# Altium project AQM with ESP32-S3.PrjPcb
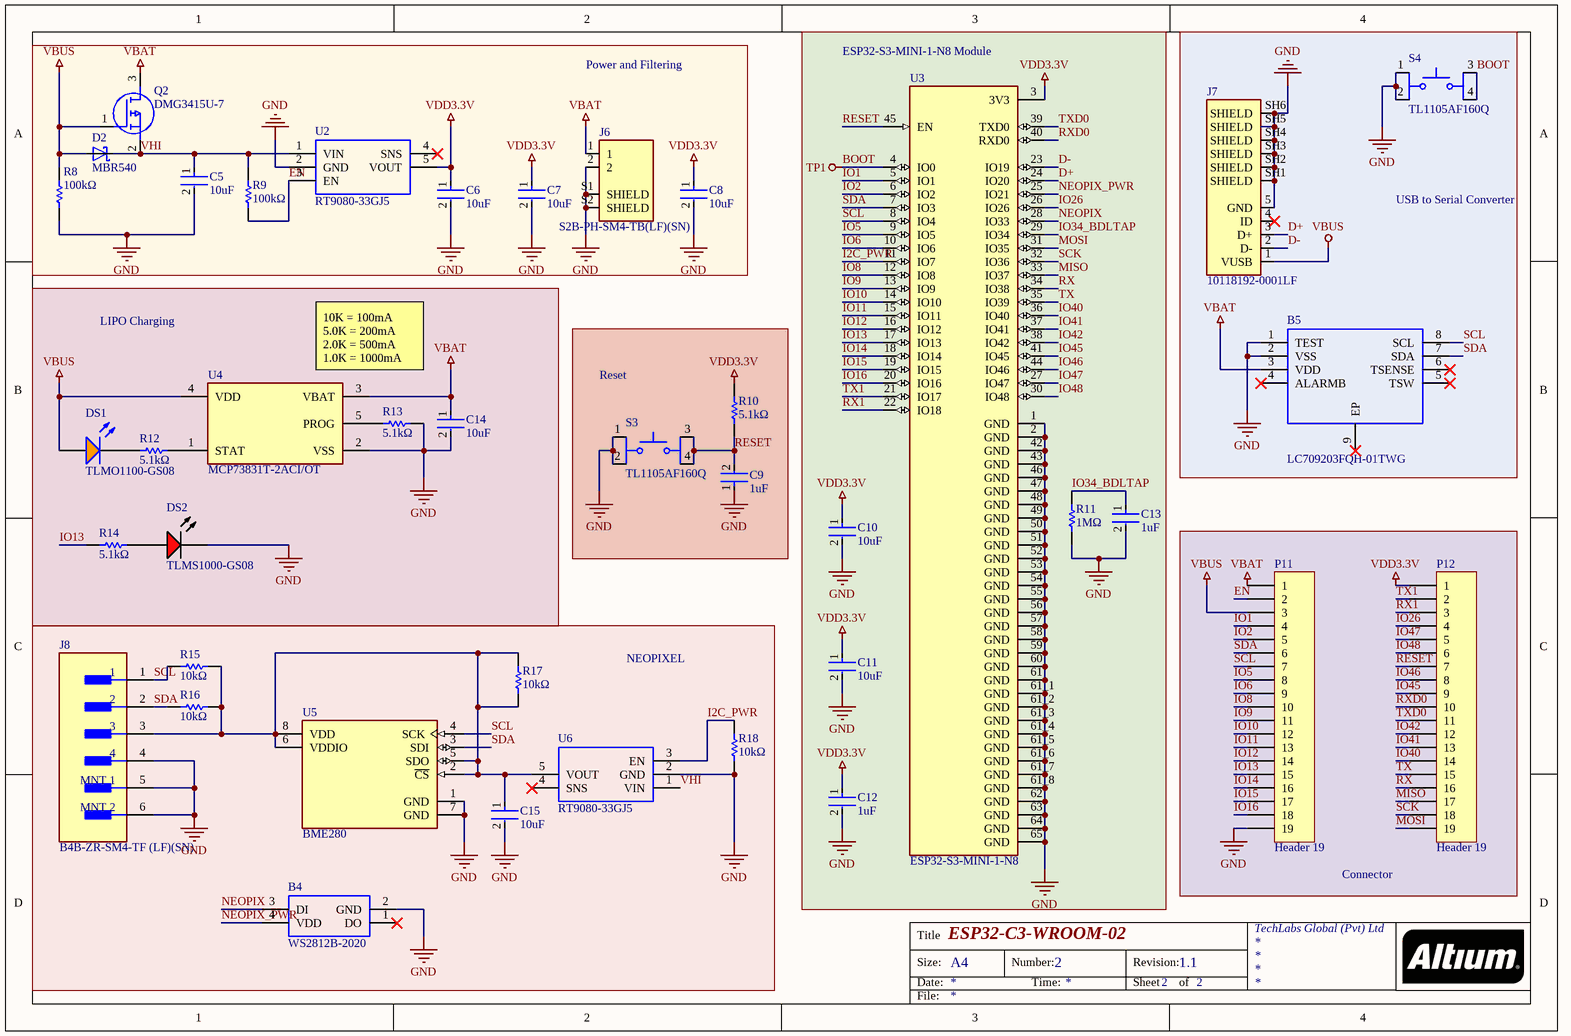
[diagram p0: ESP32-S3 module.SchDoc]
2 sheets, 76 parts. Net scope: global (net labels, ports and power ports of the same name join across sheets).
Board file: AQM with ESP32-S3.PcbDoc
Sheets:
  ESP32-S3 module.SchDoc
  AQM with esp32.SchDoc

## Sheet ESP32-S3 module.SchDoc: ESP32-C3-WROOM-02
size A4; Organization: TechLabs Global (Pvt) Ltd; DocumentNumber: 2; Revision: 1.1; SheetNumber: 2; SheetTotal: 2

### Parts
B4  WS2812B-2020  [WS2812B2020]
B5  LC709203FQH-01TWG  [SON65P400X300X80-9N]
C5  10uF  [FP-CL10-IPC_C]
C6  10uF  [FP-CL10-IPC_C]
C7  10uF  [FP-CL10-IPC_C]
C8  10uF  [FP-CL10-IPC_C]
C9  1uF  [FP-CL10-IPC_A]
C10  10uF  [FP-CL10-IPC_C]
C11  10uF  [FP-CL10-IPC_C]
C12  1uF  [FP-CL10-IPC_A]
C13  1uF  [FP-CL10-IPC_A]
C14  10uF  [FP-CL10-IPC_C]
C15  10uF  [FP-CL10-IPC_C]
D2  MBR540  [DIOAD2120W130L950D530P]
DS1  TLMO1100-GS08  [VISH-TLMX1100-2_V]
DS2  TLMS1000-GS08  [VISH-TLMS1000_V]
J6  S2B-PH-SM4-TB(LF)(SN)  [JST_S2B-PH-SM4-TB(LF)(SN)]
J7  10118192-0001LF  [AMPHENOL_10118192-0001LF]
J8  B4B-ZR-SM4-TF (LF)(SN)  [FP-B4B-ZR-SM4-TF_LF_SN-MFG]
P11  Header 19  [HDR1X19]
P12  Header 19  [HDR1X19]
Q2  DMG3415U-7  [SOT96P240X120-3N]
R8  100kΩ  [RESC1005X40X25NL05T10]
R9  100kΩ  [RESC1005X40X25NL05T10]
R10  5.1kΩ  [RESC1005X40X25NL05T10]
R11  1MΩ  [RESC1005X40X25NL05T10]
R12  5.1kΩ  [RESC1005X40X25NL05T10]
R13  5.1kΩ  [RESC1005X40X25NL05T10]
R14  5.1kΩ  [RESC1005X40X25NL05T10]
R15  10kΩ  [RESC1005X40X25LL05T10]
R16  10kΩ  [RESC1005X40X25LL05T10]
R17  10kΩ  [RESC1005X40X25LL05T10]
R18  10kΩ  [RESC1005X40X25LL05T10]
S3  TL1105AF160Q  [TL1105AF160Q]
S4  TL1105AF160Q  [TL1105AF160Q]
U2  RT9080-33GJ5  [SOT94P280X100-5N]
U3  ESP32-S3-MINI-1-N8  [XCVR_ESP32-S3-MINI-1-N8]
U4  MCP73831T-2ACI/OT  [FP-C04-091-OT-IPC_B]
U5  BME280  [FP-BME280-MFG]
U6  RT9080-33GJ5  [SOT94P280X100-5N]

### Blocks framed on the sheet
Power and Filtering: C5-C8 D2 J6 Q2 R8 R9 U2
ESP32-S3-MINI-1-N8 Module: C10-C13 R11 U3
USB to Serial Converter: B5 J7 S4
LIPO Charging: C14 DS1 DS2 R12-R14 U4
Reset: C9 R10 S3
Connector: P11 P12
NEOPIXEL: B4 C15 J8 R15-R18 U5 U6

### Nets
BOOT: S4.3 S4.4 U3.4(IO0)  [also labelled TP1]
GND: B4.2(GND) B5.1(TEST) B5.2(VSS) C5.2 C6.2 C7.2 C8.2 C9.1 C10.2 C11.2 C12.2 C13.2 C14.2 C15.2 DS2.2(K) J6.2 J6.S1(SHIELD) J6.S2(SHIELD) J7.5(GND) J7.SH1(SHIELD) J7.SH2(SHIELD) J7.SH3(SHIELD) J7.SH4(SHIELD) J7.SH5(SHIELD) J7.SH6(SHIELD) J8.4 J8.5(MNT_1) J8.6(MNT_2) P11.19 R8.1 R11.1 R13.1 R18.1 S3.1 S3.2 S4.1 S4.2 U2.2(GND) U3.1(GND) U3.2(GND) U3.42(GND) U3.43(GND) U3.46(GND) U3.47(GND) U3.48(GND) U3.49(GND) U3.50(GND) U3.51(GND) U3.52(GND) U3.53(GND) U3.54(GND) U3.55(GND) U3.56(GND) U3.57(GND) U3.58(GND) U3.59(GND) U3.60(GND) U3.61(GND) U3.61_1(GND) U3.61_2(GND) U3.61_3(GND) U3.61_4(GND) U3.61_5(GND) U3.61_6(GND) U3.61_7(GND) U3.61_8(GND) U3.62(GND) U3.63(GND) U3.64(GND) U3.65(GND) U4.2(VSS) U5.1(GND) U5.7(GND) U6.2(GND)
VBAT: B5.3(VDD) C14.1 J6.1 P11.1 Q2.3(D) U4.3(VBAT)
VBUS: D2.A DS1.1(A) J7.1(VUSB) P11.3 Q2.1(G) R8.2 U4.4(VDD)
VDD3.3V: C6.1 C7.1 C8.1 C10.1 C11.1 C12.1 P12.1 R10.2 U2.5(VOUT) U3.3(3V3)
D+: J7.3(D+) U3.24(IO20)
D-: J7.2(D-) U3.23(IO19)
EN: P11.2 R9.2 U2.3(EN)
I2C_PWR: R18.2 U3.11(IO7) U6.3(EN)
IO1: P11.4 U3.5(IO1)
IO2: P11.5 U3.6(IO2)
IO5: P11.8 U3.9(IO5)
IO6: P11.9 U3.10(IO6)
IO8: P11.10 U3.12(IO8)
IO9: P11.11 U3.13(IO9)
IO10: P11.12 U3.14(IO10)
IO11: P11.13 U3.15(IO11)
IO12: P11.14 U3.16(IO12)
IO13: P11.15 R14.2 U3.17(IO13)
IO14: P11.16 U3.18(IO14)
IO15: P11.17 U3.19(IO15)
IO16: P11.18 U3.20(IO16)
IO26: P12.4 U3.26(IO26)
IO34_BDLTAP: C13.1 R11.2 U3.29(IO34)
IO40: P12.14 U3.36(IO40)
IO41: P12.13 U3.37(IO41)
IO42: P12.12 U3.38(IO42)
IO45: P12.9 U3.41(IO45)
IO46: P12.8 U3.44(IO46)
IO47: P12.5 U3.27(IO47)
IO48: P12.6 U3.30(IO48)
MISO: P12.17 U3.33(IO37)
MOSI: P12.19 U3.31(IO35)
NEOPIX: B4.3(DI) U3.28(IO33)
NEOPIX_PWR: B4.4(VDD) U3.25(IO21)
RESET: C9.2 P12.7 R10.1 S3.3 S3.4 U3.45(EN)
RX: P12.16 U3.34(IO38)
RX1: P12.3 U3.22(IO18)
RXD0: P12.10 U3.40(RXD0)
SCK: P12.18 U3.32(IO36)
SCL: B5.8(SCL) J8.1 P11.7 R15.2 U3.8(IO4) U5.4(SCK)
SDA: B5.7(SDA) J8.2 P11.6 R16.2 U3.7(IO3) U5.3(SDI)
TX: P12.15 U3.35(IO39)
TX1: P12.2 U3.21(IO17)
TXD0: P12.11 U3.39(TXD0)
VHI: C5.1 D2.C Q2.2(S) R9.1 U2.1(VIN) U6.1(VIN)
NetC15_1: C15.1 J8.3 R15.1 R16.1 R17.1 R17.2 U5.2(~{CS}) U5.5(SDO) U5.6(VDDIO) U5.8(VDD) U6.5(VOUT)
NetDS1_2: DS1.2(K) R12.2
NetDS2_1: DS2.1(A) R14.1
NetR12_1: R12.1 U4.1(STAT)
NetR13_2: R13.2 U4.5(PROG)

Not connected (* = marked no-connect by the designer): B4 1(DO)*; B5 4(ALARMB)* 5(TSW)* 6(TSENSE)* 9(EP)*; J7 4(ID)*; U2 4(SNS)*; U6 4(SNS)*

### Notes on the sheet
- (near U4) 10K = 100mA                                                                     5.0K = 200mA                                                                                        2.0K = 500mA                                                                                        1.0K = 1000mA
- Title
- Size:
- Date:
- A4
- Number:
- Time:
- Revision:
- Sheet
- of
- File:

### Library data of the parts
B4 = WS2812B-2020: RGB SMD,2x2mm Light Emitting Diodes (LED) ROHS; Manufacturer: Worldsemi; Mfr.Part #: WS2812B-2020; Package: SMD,2x2mm; Packaging: Tape & Reel (TR); LCSC Part#: C965555; Datasheet: https://www.mouser.com/pdfDocs/WS2812B-2020_V10_EN_181106150240761.pdf
B5 = LC709203FQH-01TWG: DFN-8-EP(3x4) Battery Management ICs ROHS; Manufacturer: onsemi; Mfr.Part #: LC709203FQH-01TWG; Packaging: Tape & Reel (TR); Datasheet: https://datasheet.lcsc.com/lcsc/1809111522_onsemi-LC709203FQH-01TWG_C152311.pdf; Package: DFN-8-EP(3x4); LCSC Part#: C152311
C5-C8 C10 C11 C14 C15 = CMP-13271-004224-1: X5R 25V 10uF ±20% 0603 Multilayer Ceramic Capacitors MLCC - SMD/SMT ROHS; Mfr. Part #: CL10A106MA8NRNC; Manufacturer: Samsung Electro-Mechanics; Datasheet: https://datasheet.lcsc.com/lcsc/1811110921_Samsung-Electro-Mechanics-CL10A106MA8NRNC_C96446.pdf; Value: 10uF; LCSC Part #: C96446; Package: 0603; Packaging: Tape and Reel
C9 = CMP-13271-001457-1: X5R 1uF 16V ±10% 0603 Multilayer Ceramic Capacitors MLCC - SMD/SMT ROHS; Manufacturer: Samsung Electro-Mechanics; Mfr. Part #: CL10A105KO8NNNC; Value: 1uF; LCSC Part #: C1592; Packaging: Tape & Reel (TR); Package: 0603; Datasheet: https://datasheet.lcsc.com/lcsc/2209191700_Samsung-Electro-Mechanics-CL10A105KO8NNNC_C1592.pdf
C12 C13 = CMP-13271-001457-1: X5R 1uF 16V ±10% 0603 Multilayer Ceramic Capacitors MLCC - SMD/SMT ROHS; Mfr. Part #: CL10A105KO8NNNC; Manufacturer: Samsung Electro-Mechanics; Value: 1uF; Datasheet: 0.031inch; LCSC Part #: C1592; Packaging: Tape & Reel (TR); Package: 0603
D2 = MBR540-DO-201AD: 40V 5A 580mV@5A DO-201AD Schottky Barrier Diodes (SBD) ROHS; Manufacturer: Jilin Sino-Microelectronics; Package: DO-201AD; Datasheet: https://datasheet.lcsc.com/lcsc/1811081224_Jilin-Sino-Microelectronics-MBR540-DO-201AD_C272410.pdf; LCSC Part #: C272410; Mfr. Part #: MBR540-DO-201AD
DS1 = CMP-1666-00029-1: 0603 Light Emitting Diodes (LED) ROHS; Manufacturer: Vishay Intertech; ComponentLink1URL: http://www.vishay.com/; Datasheet: https://datasheet.lcsc.com/lcsc/2207121830_Vishay-Intertech-TLMO1100-GS08_C3148192.pdf; Packaging: Tape & Reel (TR); ComponentLink2Description: Datasheet; Package: 0603; ComponentLink1Description: Manufacturer URL; Mfr. Part #: TLMO1100-GS08; LCSC Part #: C3148192; ComponentLink2URL: http://download.siliconexpert.com/pdfs/2016/8/7/12/43/26/667/vsh_/manual/379263299541529tlmb1100.pdf
DS2 = CMP-2000-07254-1: Red 0603 Light Emitting Diodes (LED) ROHS; Manufacturer: Vishay Intertech; Package: 0603; Packaging: Tape & Reel (TR); LCSC Part #: C241893; Datasheet: https://datasheet.lcsc.com/lcsc/1810181516_Vishay-Intertech-TLMS1000-GS08_C241893.pdf; Mfr. Part #: TLMS1000-GS08
J6 = S2B-PH-SM4-TB(LF)(SN): 1x2P PH 1 2mm Male pin 2 -25℃~+85℃ 2A Surface Mount SMD,P=2mm Wire To Board / Wire To Wire Connector ROHS; Manufacturer: JST Sales America; LCSC Part #: C295747; Datasheet: https://datasheet.lcsc.com/lcsc/2102031704_JST-Sales-America-S2B-PH-SM4-TB-LF-SN_C295747.pdf; Package: SMD,P=2mm; Mfr. Part #: S2B-PH-SM4-TB(LF)(SN); Packaging: Tape & Reel (TR)
J7 = 10118192-0001LF: Single Port 5 Contact Horizontal Right Angle Shielded Micro B USB 2.0 Connector; Manufacturer: Amphenol ICC; Mfr. Part #: 10118192-0001LF; Package: SMD; LCSC Part #: C132564; Datasheet: https://datasheet.lcsc.com/lcsc/2111290930_Amphenol-ICC-10118192-0001LF_C132564.pdf
J8 = CMP-17439-000604-1: 1x4P 1 1.5mm 4 Brass SMD,P=1.5mm Wire To Board / Wire To Wire Connector ROHS; Manufacturer: JST Sales America; Packaging: Tape & Reel (TR); Mfr. Part #: B4B-ZR-SM4-TF(LF)(SN); LCSC Part #: C265083; Package: SMD,P=1.5mm; Datasheet: https://datasheet.lcsc.com/lcsc/1912111437_JST-Sales-America-B4B-ZR-SM4-TF-LF-SN_C265083.pdf
P11 P12 = Header 19: Header, 19-Pin; LatestRevisionDate: 17-Jul-2002; LatestRevisionNote: Re-released for DXP Platform.; Publisher: Altium Limited
Q2 = DMG3415U-7: 20V 4A 39mΩ@4.5V,4A 900mW P Channel SOT-23 MOSFETs ROHS; Manufacturer: Diodes Incorporated; Mfr.Part #: DMG3415U-7; Packaging: Tape & Reel (TR); Package: SOT-23; Datasheet: https://datasheet.lcsc.com/lcsc/1809191942_Diodes-Incorporated-DMG3415U-7_C96616.pdf; LCSC Part#: C96616
R8 R9 = CMP-2002-07343-1: 62.5mW 100kΩ ±1% Thick Film Resistors 0402 Chip Resistor - Surface Mount ROHS; Mfr.Part #: RC0402FR-07100KL; Manufacturer: YAGEO; Value: 100kΩ; LCSC Part#: C60491; Datasheet: https://datasheet.lcsc.com/lcsc/1809291220_YAGEO-RC0402FR-07100KL_C60491.pdf; Packaging: Tape & Reel (TR); Package: 0402
R10 R12-R14 = CMP-2002-07753-1: 62.5mW Thick Film Resistors ±1% 5.1kΩ 0402 Chip Resistor - Surface Mount ROHS; Mfr. Part #: RC0402FR-075K1L; Manufacturer: YAGEO; Datasheet: https://datasheet.lcsc.com/lcsc/1809201112_YAGEO-RC0402FR-075K1L_C105872.pdf; LCSC Part #: C105872; Package: 0402; Packaging: Tape & Reel (TR); Value: 5.1kΩ
R11 = CMP-2002-07490-1: 62.5mW Thick Film Resistors ±1% 1MΩ 0402 Chip Resistor - Surface Mount ROHS; Mfr. Part #: RC0402FR-071ML; Manufacturer: YAGEO; Datasheet: https://datasheet.lcsc.com/lcsc/1809201123_YAGEO-RC0402FR-071ML_C138033.pdf; LCSC Part #: C138033; Package: 0402; Packaging: Tape & Reel (TR); Value: 1MΩ
R15-R18 = CMP-2002-07353-1: 10kΩ Thick Film Resistors 62.5mW ±1% 0402 Chip Resistor - Surface Mount ROHS; Mfr. Part #: RC0402FR-0710KL; Manufacturer: YAGEO; Value: 10kΩ; LCSC Part #: C60490; Package: 0402; Datasheet: https://datasheet.lcsc.com/lcsc/1809301715_YAGEO-RC0402FR-0710KL_C60490.pdf; Packaging: Tape & Reel (TR)
S3 S4 = TL1105AF160Q: 6mm 1.4mm Round Button 50mA Straight 6mm SPST 12V Plugin,6x6mm Tactile Switches ROHS; Manufacturer: E-Switch; Datasheet: https://datasheet.lcsc.com/lcsc/1809291031_E-Switch-TL1105AF160Q_C273465.pdf; Mfr. Part #: TL1105AF160Q; Package: Plugin,6x6mm; LCSC Part #: C273465; Packaging: Bag-packed
U2 U6 = RT9080-33GJ5: TSOT-23-5 Linear Voltage Regulators (LDO) ROHS; Manufacturer: Richtek Tech; Mfr.Part #: RT9080-33GJ5; Package: TSOT-23-5; LCSC Part#: C841192; Datasheet: https://datasheet.lcsc.com/lcsc/2009192305_Richtek-Tech-RT9080-33GJ5_C841192.pdf; Packaging: Tape & Reel (TR)
U3 = U?: Bluetooth, WiFi 802.11b/g/n, Bluetooth v5.0 Transceiver Module 2.4GHz PCB Trace Surface Mount; Manufacturer: Espressif Systems; Mfr. Part #: ESP32-S3-MINI-1-N8; Datasheet: https://www.espressif.com/sites/default/files/documentation/esp32-s3-mini-1_mini-1u_datasheet_en.pdf; LCSC Part #: C2913206; Package: None; Packaging: Tape & Reel (TR)
U4 = CMP-0133-00143-2: SOT-23-5 Battery Management ICs ROHS; Manufacturer: Microchip Tech; LCSC Part #: C424093; Mfr. Part #: MCP73831T-2ACI/OT; Package: SOT-23-5; Packaging: Tape & Reel (TR); Datasheet: https://datasheet.lcsc.com/lcsc/1912111437_Microchip-Tech-MCP73831T-2ACI-OT_C424093.pdf
U5 = CMP-2000-05073-3: LGA-8 Temperature and Humidity Sensor ROHS; Manufacturer: Bosch Sensortec; Packaging: Tape & Reel (TR); Datasheet: https://datasheet.lcsc.com/lcsc/2302171709_Bosch-Sensortec-BME280_C92489.pdf; LCSC Part #: C92489; Mfr. Part #: BME280; Package: LGA-8

## Sheet AQM with esp32.SchDoc: Air Quaity Monitor
size A4; Organization: TechLabs Global (Pvt) Ltd; DocumentNumber: 1; Revision: 1.1; SheetNumber: 1; SheetTotal: 2
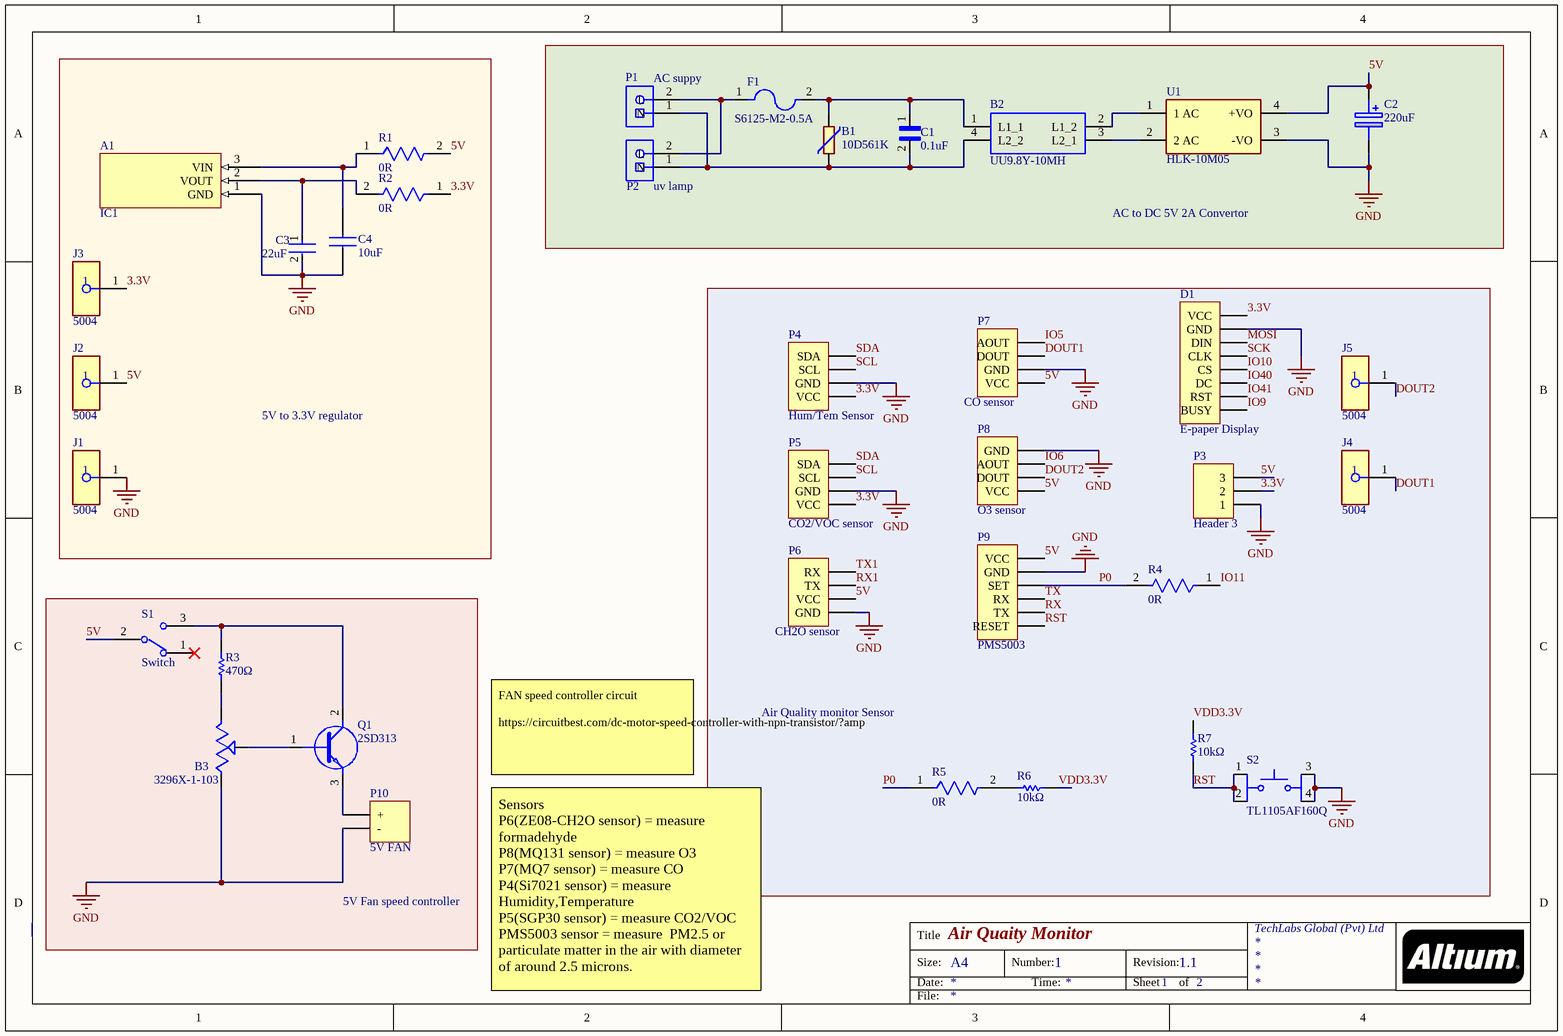
[diagram p1: AQM with esp32.SchDoc]

### Parts
A1  IC1  [SOT89-150P350X150-3N]
B1  10D561K  [10D561K]
B2  UU9.8Y-10MH  [UU98Y10MH]
B3  3296X-1-103  [3296X1223LF]
C1  0.1uF  [MPX-104K275VAC-C-D2]
C2  220uF  [CAPAE830X1050N]
C3  22uF  [FP-GRM219-0_2-0_15-IPC_A]
C4  10uF  [CL05A106MQ5NUNC]
D1  E-paper Display  [HDR1X8]
F1  S6125-M2-0.5A  [CAPC6125X25N]
J1  5004  [FP-5004-MFG]
J2  5004  [FP-5004-MFG]
J3  5004  [FP-5004-MFG]
J4  5004  [FP-5004-MFG]
J5  5004  [FP-5004-MFG]
P1  AC suppy  [PHOE-1729128-2_V]
P2  uv lamp  [PHOE-1729128-2_V]
P3  Header 3  [HDR1X3]
P4  Hum/Tem Sensor  [HDR1X4]
P5  CO2/VOC sensor  [HDR1X4]
P6  CH2O sensor  [HDR1X4]
P7  CO sensor  [HDR1X4]
P8  O3 sensor  [HDR1X4]
P9  PMS5003  [HDR1X6]
P10  5V FAN  [HDR1X2]
Q1  2SD313  [TO304P498X1010X2089-3P]
R1  0R  [FP-RC0402-0_4-IPC_A]
R2  0R  [FP-RC0402-0_4-IPC_A]
R3  470Ω  [RESC1608X55X25LL10T15]
R4  0R  [FP-RC0402-0_4-IPC_A]
R5  0R  [FP-RC0402-0_4-IPC_A]
R6  10kΩ  [RESC1005X40X25LL05T10]
R7  10kΩ  [RESC1005X40X25LL05T10]
S1  Switch  [SK3245SL1A]
S2  TL1105AF160Q  [TL1105AF160Q]
U1  HLK-10M05  [FP-HLK-10M05-MFG]

### Blocks framed on the sheet
5V to 3.3V regulator: A1 C3 C4 J1-J3 R1 R2
AC to DC 5V 2A Convertor: B1 B2 C1 C2 F1 P1 P2 U1
Air Quality monitor Sensor: D1 J4 J5 P3-P9 R4-R7 S2
5V Fan speed controller: B3 P10 Q1 R3 S1

### Nets
GND: A1.1(GND) B3.1(A) C2.2(-) C3.2 C4.1 D1.7(GND) J1.1 P3.1 P4.2(GND) P5.2(GND) P6.1(GND) P7.2(GND) P8.4(GND) P9.5(GND) P10.2(-) S2.3 S2.4 U1.3(-VO)
VDD3.3V: R6.1 R7.1
3.3V: D1.8(VCC) J3.1 P3.2 P4.1(VCC) P5.1(VCC) R2.1
5V: C2.1(+) J2.1 P3.3 P6.2(VCC) P7.1(VCC) P8.1(VCC) P9.6(VCC) R1.2 S1.2 U1.4(+VO)
DOUT1: J4.1 P7.3(DOUT)
DOUT2: J5.1 P8.2(DOUT)
IO5: P7.4(AOUT)
IO6: P8.3(AOUT)
IO9: D1.1(BUSY)
IO10: D1.4(CS)
IO11: R4.1
IO40: D1.3(DC)
IO41: D1.2(RST)
MOSI: D1.6(DIN)
P0: P9.4(SET) R4.2 R5.1
RST: P9.1(RESET) R7.2 S2.1 S2.2
RX: P9.2(TX)
RX1: P6.3(TX)
SCK: D1.5(CLK)
SCL: P4.3(SCL) P5.3(SCL)
SDA: P4.4(SDA) P5.4(SDA)
TX: P9.3(RX)
TX1: P6.4(RX)
NetA1_2: A1.2(VOUT) C3.1 R2.2
NetA1_3: A1.3(VIN) C4.2 R1.1
NetB1_1: B1.1 B2.1(L1_1) C1.1 F1.2
NetB1_2: B1.2 B2.4(L2_2) C1.2 P1.1(N) P2.1(N)
NetB2_2: B2.2(L1_2) U1.1(1_AC)
NetB2_3: B2.3(L2_1) U1.2(2_AC)
NetB3_2: B3.2(B) Q1.1(B)
NetB3_3: B3.3(C) R3.1
NetF1_1: F1.1 P1.2(L) P2.2(L)
NetP10_1: P10.1(+) Q1.3(E)
NetQ1_2: Q1.2(C) R3.2 S1.3
NetR5_2: R5.2 R6.2

Not connected (* = marked no-connect by the designer): S1 1*

### Notes on the sheet
- FAN speed controller circuit
  https://circuitbest.com/dc-motor-speed-controller-with-npn-transistor/?amp
- Sensors
  P6(ZE08-CH2O sensor) = measure formadehyde
  P8(MQ131 sensor) = measure O3
  P7(MQ7 sensor) = measure CO
  P4(Si7021 sensor) = measure Humidity,Temperature
  P5(SGP30 sensor) = measure CO2/VOC
  PMS5003 sensor = measure  PM2.5 or particulate matter in the air with diameter of around 2.5 microns.
- Title
- Size:
- Date:
- A4
- Number:
- Time:
- Revision:
- Sheet
- of
- File:

### Library data of the parts
A1 = IC?: 75dB@(120Hz) 1A 1.25V@(1A) ±125℃@(Tj) Fixed 3.3V~3.3V Positive 1 20V SOT-89 Linear Voltage Regulators (LDO) ROHS; Manufacturer: YONGYUTAI; Mfr. Part #: AMS1117-3.3; LCSC Part #: C2904742; Package: SOT-89; Datasheet: https://datasheet.lcsc.com/lcsc/2110121330_YONGYUTAI-AMS1117-3-3_C2904742.pdf
B1 = 10D561K: 920V 42.3J 180pF@1kHz 460V 350V 504V~616V 2.5kA Plugin Varistors ROHS; Manufacturer: Hongzhi Elec; Datasheet: https://datasheet.lcsc.com/lcsc/1811141751_Hongzhi-Elec-10D561K_C113236.pdf; LCSC Part #: C113236; Mfr. Part #: 10D561K; Package: Plugin
B2 = UU9.8Y-10MH: 10mH@1kHz 1.2Ω 2 500mA 50V Plugin Common Mode Filters ROHS; Manufacturer: FH (Guangdong Fenghua Advanced Tech); Mfr. Part #: UU9.8Y-10MH; Package: Plugin; Datasheet: https://datasheet.lcsc.com/lcsc/1810311213_FH--Guangdong-Fenghua-Advanced-Tech-UU9-8Y-10mH_C75192.pdf; LCSC Part #: C75192
B3 = 3296X-1-103: ±10% 10kΩ Plugin Variable Resistors/Potentiometers ROHS; Manufacturer: BOCHEN(Chengdu Guosheng Tech); Mfr. Part #: 3296X-1-103; Package: Plugin; LCSC Part #: C118955; Datasheet: https://datasheet.lcsc.com/lcsc/1811011704_BOCHEN-Chengdu-Guosheng-Tech-3296X-1-103_C118955.pdf
C1 = MPX-104K275VAC-C-D2: X2 100nF ±10% 275V Plugin,P=15mm Suppression Capacitors ROHS; Manufacturer: NDF; Mfr. Part #: X2-104K-275VAC; LCSC Part #: C914484; Package: Plugin,P=15mm; Datasheet: https://datasheet.lcsc.com/lcsc/2201131300_NDF-X2-104K-275VAC_C914484.pdf; Value: 0.1uF
C2 = UUR1C221MNL1GS: -40℃~+85℃ 2000hrs@85℃ 220uF 10mm 16V 8mm 215mA@120Hz ±20% SMD,D8xL10mm Aluminum Electrolytic Capacitors - SMD ROHS; Manufacturer: Nichicon; Mfr. Part #: UUR1C221MNL1GS; Package: SMD,D8xL10mm; Datasheet: https://datasheet.lcsc.com/lcsc/2002121532_Nichicon-UUR1C221MNL1GS_C445237.pdf; LCSC Part #: C445237; Value: 220uF
C3 = CMP-06035-056251-1: Chip Multilayer Ceramic Capacitors for General Purpose, 0805, 22uF, X5R, 15%, 20%, 16V; Mfr. Part #: GRM219R61C226ME15L; Manufacturer: Murata Electronics; value: 22uF; Datasheet: https://datasheet.lcsc.com/lcsc/1811141821_Murata-Electronics-GRM219R61C226ME15L_C162295.pdf; LCSC Part #: C162295; Package: 0805
C4 = CL05A106MQ5NUNC: 6.3V 10uF X5R ±20% 0402 Multilayer Ceramic Capacitors MLCC - SMD/SMT ROHS; Manufacturer: Samsung Electro-Mechanics; Mfr. Part #: CL05A106MQ5NUNC; LCSC Part #: C15525; value: 10uF; Datasheet Link: https://datasheet.datasheetarchive.com/originals/distributors/Datasheets-DGA10/2406160.pdf; Package: 0402
D1 = Header 8: Header, 8-Pin; LatestRevisionDate: 17-Jul-2002; LatestRevisionNote: Re-released for DXP Platform.; Publisher: Altium Limited
F1 = S6125-M2-0.5A: SMD Fuses ROHS; Manufacturer: SART(Nanjing Sart Tech); LCSC Part #: C845172; Mfr. Part #: S6125-M2-0.5A; Package: SMD; Datasheet: https://datasheet.lcsc.com/lcsc/2201242130_SART-Nanjing-Sart-Tech-S6125-M2-0-5A_C845172.pdf
J1-J5 = CMP-2000-05575-2: PC TEST POINT MINIATURE YELLOW; Manufacturer: Keystone; Datasheet: https://datasheet.lcsc.com/lcsc/2201121200_Keystone-5004_C2906762.pdf; LCSC Part #: C2906762; ComponentLink2URL: https://www.keyelco.com/product-pdf.cfm?p=1313; ComponentLink2Description: Datasheet; Package: 5004; Mfr. Part #: 5004
P1 P2 = CMP-2000-05815-1: 13.5A 400V Green Straight pin 5.08mm 1 2 Plugin,P=5.08mm Screw terminal ROHS; Mfr. Part #: 1729128; Manufacturer: Phoenix Contact; Datasheet: https://www.farnell.com/datasheets/2617011.pdf; LCSC Part #: C91153; Package: Plugin,P=5.08mm
P3 = Header 3: Header, 3-Pin; LatestRevisionDate: 17-Jul-2002; LatestRevisionNote: Re-released for DXP Platform.; Publisher: Altium Limited
P4 = Header 4: Si7021 Header, 4-Pin
P5 = Header 4: SGP30 Header, 4-Pin; LatestRevisionDate: 17-Jul-2002; LatestRevisionNote: Re-released for DXP Platform.; Publisher: Altium Limited
P6 = Header 4: - Sensor Modules ROHS; Mfr. Part #: ZE08-CH2O; Manufacturer: Zhengzhou Winsen Elec Tech; LCSC Part #: C141344
P7 = Header 4: MQ7 Header, 4-Pin; LatestRevisionDate: 17-Jul-2002; LatestRevisionNote: Re-released for DXP Platform.; Publisher: Altium Limited
P8 = Header 4: MQ131 Header, 4-Pin; LatestRevisionDate: 17-Jul-2002; LatestRevisionNote: Re-released for DXP Platform.; Publisher: Altium Limited
P9 = Header 6: PMS5003 Sensor Modules ROHS; Manufacturer: Beijing Plantower; Datasheet: https://datasheet.lcsc.com/lcsc/1810251510_Beijing-Plantower-PMS5003_C91431.pdf; LCSC Part #: C91431; Package: PMS5003; Mfr. Part #: PMS5003
P10 = Header 2: Header, 2-Pin; LatestRevisionDate: 17-Jul-2002; LatestRevisionNote: Re-released for DXP Platform.; Publisher: Altium Limited
Q1 = 2SD313: NPN Transistor, TO-220; Manufacturer: Jiangsu Changjing Electronics Technology Co., Ltd.; Mfr. Part #: 2SD313; Datasheet: https://datasheet.lcsc.com/lcsc/2206081730_Jiangsu-Changjing-Electronics-Technology-Co---Ltd--2SD313_C3031919.pdf; LCSC Part #: C3031919; Package: TO-220
R1 R2 R4 R5 = CMP-2002-07342-2: RES SMD 0 OHM JUMPER 1/16W 0402; Manufacturer: Yageo; Mfr. Part #: RC0402FR-070RL; value: 0R; Package: 0402; LCSC Part #: C106231; Datasheet: https://www.lcsc.com/product-detail/Chip-Resistor-Surface-Mount_YAGEO-RC0402FR-070RL_C106231.html
R3 = CMP-1659-00035-2: 100mW Thick Film Resistors 75V ±100ppm/℃ ±1% -55℃~+155℃ 470Ω 0603 Chip Resistor - Surface Mount ROHS; Mfr. Part #: RC0603FR-07470RL; Manufacturer: YAGEO; ComponentLink1Description: Manufacturer URL; Value: 470Ω; ComponentLink1URL: http://www.yageo.com/; LCSC Part #: C114669; ComponentLink2URL: https://datasheet.ciiva.com/11808/0900766b80f96399-11808177.pdf; Package: 0603; ComponentLink2Description: Datasheet; Datasheet: https://datasheet.lcsc.com/lcsc/1810161617_YAGEO-RC0603FR-07470RL_C114669.pdf
R6 R7 = CMP-2002-07353-1: 50V 10kΩ Thick Film Resistors 62.5mW ±1% -55℃~+155℃ ±100ppm/℃ 0402 Chip Resistor - Surface Mount ROHS; Mfr. Part #: RC0402FR-0710KL; Manufacturer: YAGEO; Value: 10kΩ; LCSC Part #: C60490; Package: 0402
S1 = SK-3245S-L1-A: Surface Mount 50mA DPDT 3.2mm 12V 9.1mm 12V 3.55mm 50mA 10000 SMDSplicing Rectangular columnar -40℃~+85℃ Black SMD Slide Switches ROHS; Manufacturer: XKB Connectivity; Package: SMD; Datasheet: https://datasheet.lcsc.com/lcsc/2002271841_XKB-Connectivity-SK-3245S-L1-A_C405951.pdf; Mfr. Part #: SK-3245S-L1-A; LCSC Part #: C405951
S2 = TL1105AF160Q: as S3 on sheet ESP32-S3 module; Datasheet: https://datasheet.lcsc.com/lcsc/1809291031_E-Switch-TL1105AF160Q_C273465.pdf; Mfr. Part #: TL1105AF160Q; Package: Plugin,6x6mm; LCSC Part #: C273465
U1 = CMP-218581-000001-1: 5V 2A 90VAC~265VAC 1 120V~350V Isolated Regulated 10W AC-DC 80% Plugin Power Modules ROHS; Manufacturer: HI-LINK; Mfr. Part #: HLK-10M05; LCSC Part #: C403745; Package: Plugin

## Nets that join several sheets
GND: ESP32-S3 module (74 pins), AQM with esp32 (18 pins)
VDD3.3V: ESP32-S3 module (10 pins), AQM with esp32 (R6.1 R7.1)
IO5: ESP32-S3 module (P11.8 U3.9), AQM with esp32 (P7.4)
IO6: ESP32-S3 module (P11.9 U3.10), AQM with esp32 (P8.3)
IO9: ESP32-S3 module (P11.11 U3.13), AQM with esp32 (D1.1)
IO10: ESP32-S3 module (P11.12 U3.14), AQM with esp32 (D1.4)
IO11: ESP32-S3 module (P11.13 U3.15), AQM with esp32 (R4.1)
IO40: ESP32-S3 module (P12.14 U3.36), AQM with esp32 (D1.3)
IO41: ESP32-S3 module (P12.13 U3.37), AQM with esp32 (D1.2)
MOSI: ESP32-S3 module (P12.19 U3.31), AQM with esp32 (D1.6)
RX: ESP32-S3 module (P12.16 U3.34), AQM with esp32 (P9.2)
RX1: ESP32-S3 module (P12.3 U3.22), AQM with esp32 (P6.3)
SCK: ESP32-S3 module (P12.18 U3.32), AQM with esp32 (D1.5)
SCL: ESP32-S3 module (6 pins), AQM with esp32 (P4.3 P5.3)
SDA: ESP32-S3 module (6 pins), AQM with esp32 (P4.4 P5.4)
TX: ESP32-S3 module (P12.15 U3.35), AQM with esp32 (P9.3)
TX1: ESP32-S3 module (P12.2 U3.21), AQM with esp32 (P6.4)